# Altium schematic sheet debug_interface.SchDoc
size A4
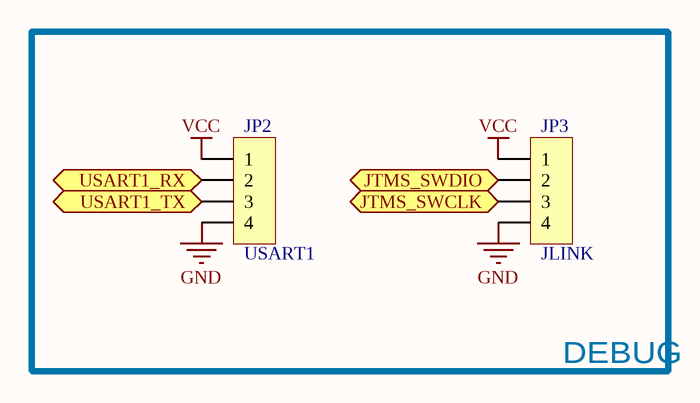
[diagram p0: debug_interface.SchDoc]

## Parts
JP2  USART1  [MX 1.25-LS-4P]
JP3  JLINK  [MX 1.25-LS-4P]

## Blocks framed on the sheet
DEBUG: JP2 JP3

## Ports
JTMS_SWCLK (bidir), JTMS_SWDIO (bidir), USART1_RX (bidir), USART1_TX (bidir)

## Nets
GND: JP2.4 JP3.4
VCC: JP2.1 JP3.1
JTMS_SWCLK: JP3.3 ; port JTMS_SWCLK
JTMS_SWDIO: JP3.2 ; port JTMS_SWDIO
USART1_RX: JP2.2 ; port USART1_RX
USART1_TX: JP2.3 ; port USART1_TX

## Library data of the parts
JP2 JP3 = Header 4: 4P接插件; 版权归属: 源创客; BOM名称: 4P接插件; 学习资源: www.ooocke.com